# Altium schematic sheet Sheet1.SchDoc
size A
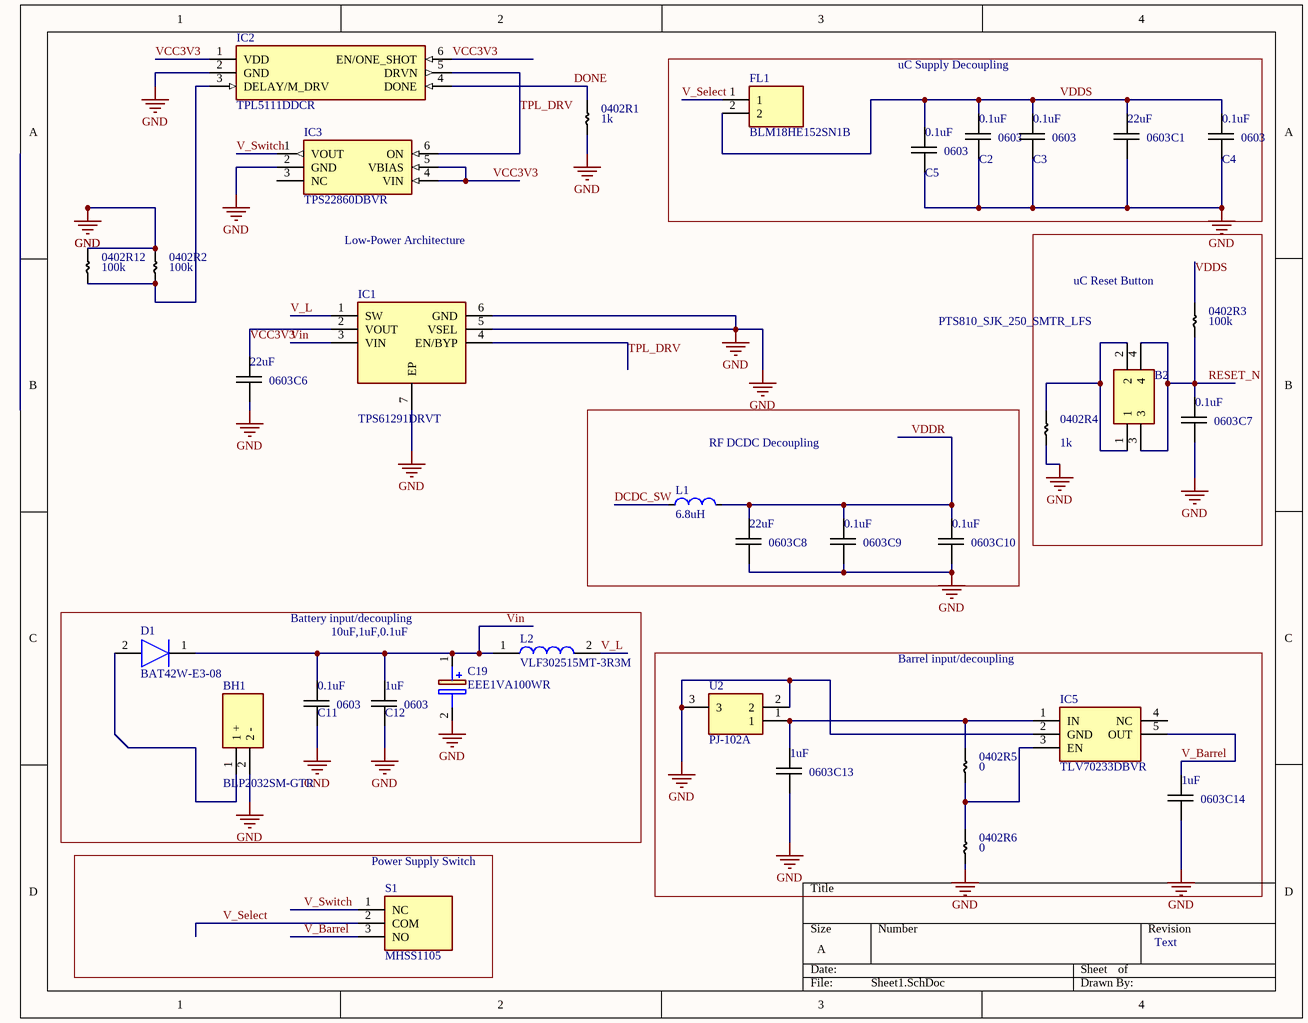
[diagram p0: Sheet1.SchDoc]

## Parts
B2  PTS810_SJK_250_SMTR_LFS  [PTS810SJK250SMTRLFS]
BH1  BLP2032SM-GTR  [BLP2032SMGTR]
C1  22uF  [0603_SMD]
C2  0.1uF  [0603_SMD]
C3  0.1uF  [0603_SMD]
C4  0.1uF  [0603_SMD]
C5  0.1uF  [0603_SMD]
C6  22uF  [0603_SMD]
C7  0.1uF  [0603_SMD]
C8  22uF  [0603_SMD]
C9  0.1uF  [0603_SMD]
C10  0.1uF  [0603_SMD]
C11  0.1uF  [0603_SMD]
C12  1uF  [0603_SMD]
C13  1uF  [0603_SMD]
C14  1uF  [0603_SMD]
C19  EEE1VA100WR  [CAPAE430X550N]
D1  BAT42W-E3-08  [SOD3716X135N]
FL1  BLM18HE152SN1B  [BEADC1608X95N]
IC1  TPS61291DRVT  [SON65P200X200X80-7N]
IC2  TPL5111DDCR  [SOT95P280X110-6N]
IC3  TPS22860DBVR  [SOT95P280X145-6N]
IC5  TLV70233DBVR  [SOT95P280X145-5N]
L1  value 6.8uH  [PASSIVE-INDUCTOR-0603]  (hidden comment: Passive-Inductor (Generic))
L2  VLF302515MT-3R3M  [VLF302515MT]
R1  1k  [0402_SMD]
R2  100k  [0402_SMD]
R3  100k  [0402_SMD]
R4  1k  [0402_SMD]
R5  0  [0402_SMD]
R6  0  [0402_SMD]
R12  100k  [0402_SMD]
S1  MHSS1105  [MHSS1105]
U2  PJ-102A  [PJ-102AH]

## Blocks framed on the sheet
uC Supply Decoupling: C1-C5 FL1
uC Reset Button: B2 C7 R3 R4
RF DCDC Decoupling: C8-C10 L1
Barrel input/decoupling: C13 C14 IC5 R5 R6 U2
Power Supply Switch: S1

## Nets
GND: BH1.2(2_-) C1.1 C2.1 C3.1 C4.1 C5.1 C6.1 C7.1 C8.1 C9.1 C10.1 C11.1 C12.1 C13.1 C14.1 C19.2(-) IC1.5(VSEL) IC1.6(GND) IC1.7(EP) IC2.2(GND) IC3.2(GND) IC5.2(GND) R1.2 R2.1 R4.2 R6.2 R12.1 U2.2 U2.3
DCDC_SW: L1.1
DONE: IC2.4(DONE) R1.1
RESET_N: B2.3 B2.4 C7.2 R3.2
TPL_DRV: IC1.4(EN/BYP) IC2.5(DRVN) IC3.6(ON)
V_Barrel: C14.2 IC5.5(OUT) S1.3(NO)
V_L: IC1.1(SW) L2.2
V_Select: FL1.1 S1.2(COM)
V_Switch: IC3.1(VOUT) S1.1(NC)
VCC3V3: C6.2 IC1.2(VOUT) IC2.1(VDD) IC2.6(EN/ONE_SHOT) IC3.4(VIN) IC3.5(VBIAS)
VDDR: C8.2 C9.2 C10.2 L1.2
VDDS: C1.2 C2.2 C3.2 C4.2 C5.2 FL1.2 R3.1
Vin: C11.2 C12.2 C19.1(+) D1.1(K) IC1.3(VIN) L2.1
NetB2_1: B2.1 B2.2 R4.1
NetBH1_1: BH1.1(1_+) D1.2(A)
NetC13_2: C13.2 IC5.1(IN) R5.1 U2.1
NetIC2_3: IC2.3(DELAY/M_DRV) R2.2 R12.2
NetIC5_3: IC5.3(EN) R5.2 R6.1

Not connected (* = marked no-connect by the designer): IC3 3(NC); IC5 4(NC)

## Notes on the sheet
- Low-Power Architecture
- (near C19) Battery input/decoupling
- 10uF,1uF,0.1uF
- Text
- (in symbol C_0603) 0603
- (in symbol R_0402) 0402

## Library data of the parts
B2 = PTS810_SJK_250_SMTR_LFS: Crystal or Oscillator; Manufacturer_Name: C & K COMPONENTS; Manufacturer_Part_Number: PTS810 SJK 250 SMTR LFS; Datasheet Link: https://www.ckswitches.com/media/1476/pts810.pdf; Height: 2mm; Mouser Part Number: 611-PTS810SJK250SMTR; Mouser Price/Stock: https://www.mouser.com/Search/Refine.aspx?Keyword=611-PTS810SJK250SMTR
BH1 = BLP2032SM-GTR: Undefined or Miscellaneous; Manufacturer_Name: MPD (Memory Protection Devices); Datasheet Link: http://www.memoryprotectiondevices.com/datasheets/BLP2032SM-GTR-datasheet.pdf; Height: 4.75mm; Manufacturer_Part_Number: BLP2032SM-GTR
C1-C14 = C_0603
C19 = EEE1VA100WR: Capacitor Polarised; Manufacturer_Name: Panasonic; Datasheet Link: https://industrial.panasonic.com/cdbs/www-data/pdf/RDE0000/ABA0000C1145.pdf; Height: 5.5mm; Manufacturer_Part_Number: EEE1VA100WR; RS Part Number: 1766382; RS Price/Stock: https://uk.rs-online.com/web/p/products/1766382
D1 = BAT42W-E3-08: Diode; Manufacturer_Name: Vishay; Datasheet Link: http://www.vishay.com/docs/85661/bat42w.pdf; Height: 1.35mm; Manufacturer_Part_Number: BAT42W-E3-08; Mouser Part Number: 78-BAT42W-E3-08; Mouser Price/Stock: https://www.mouser.com/Search/Refine.aspx?Keyword=78-BAT42W-E3-08; RS Part Number: 1808601P; RS Price/Stock: http://uk.rs-online.com/web/p/products/1808601P
FL1 = BLM18HE152SN1B: Filter; Manufacturer_Name: Murata Electronics; Datasheet Link: https://www.murata.com/en-us/products/productdetail?partno=BLM18HE152SN1%23; Height: 0.95mm; Manufacturer_Part_Number: BLM18HE152SN1B; Mouser Part Number: N/A; Mouser Price/Stock: https://www.mouser.com/Search/Refine.aspx?Keyword=N%2FA
IC1 = TPS61291DRVT: Integrated Circuit; Manufacturer_Name: Texas Instruments; Datasheet Link: http://uk.rs-online.com/web/p/products/9143112P; Height: 0.8mm; Manufacturer_Part_Number: TPS61291DRVT; Mouser Part Number: 595-TPS61291DRVT; Mouser Price/Stock: https://www.mouser.com/Search/Refine.aspx?Keyword=595-TPS61291DRVT; RS Part Number: 9143112P; RS Price/Stock: http://uk.rs-online.com/web/p/products/9143112P
IC2 = TPL5111DDCR: Undefined or Miscellaneous; Manufacturer_Name: Texas Instruments; Datasheet Link: http://www.ti.com/lit/ds/symlink/tpl5111.pdf; Height: 1.1mm; Manufacturer_Part_Number: TPL5111DDCR; Mouser Part Number: 595-TPL5111DDCR; Mouser Price/Stock: https://www.mouser.com/Search/Refine.aspx?Keyword=595-TPL5111DDCR
IC3 = TPS22860DBVR: Switch; Manufacturer_Name: Texas Instruments; Datasheet Link: http://www.ti.com/lit/gpn/tps22860; Height: 1.45mm; Manufacturer_Part_Number: TPS22860DBVR; Mouser Part Number: 595-TPS22860DBVR; Mouser Price/Stock: https://www.mouser.com/Search/Refine.aspx?Keyword=595-TPS22860DBVR
IC5 = TLV70233DBVR: Integrated Circuit; Manufacturer_Name: Texas Instruments; Datasheet Link: http://www.ti.com/lit/gpn/tlv702; Height: 1.45mm; Manufacturer_Part_Number: TLV70233DBVR; Mouser Part Number: 595-TLV70233DBVR; Mouser Price/Stock: https://www.mouser.com/Search/Refine.aspx?Keyword=595-TLV70233DBVR
L1 = Passive-Inductor (Generic): Generic Inductor; Category: Passive; Manufacturer: *; Supplier 2: Digi-Key; Manufacturer Part Number: *; Supplier 1: Mouser; Package: *; Supplier Part Number 1: *; Supplier Part Number 2: *; Through Hole (y/n): *
L2 = VLF302515MT-3R3M: Inductor; Manufacturer_Name: TDK; Datasheet Link: https://product.tdk.com/info/en/documents/wdcatalog/withdrawn_inductor_commercial_power_vlf302515mt_en.pdf; Manufacturer_Part_Number: VLF302515MT-3R3M; Mouser Part Number: 810-VLF302515MT-3R3M; Mouser Price/Stock: https://www.mouser.com/Search/Refine.aspx?Keyword=810-VLF302515MT-3R3M
R1-R6 R12 = R_0402
S1 = MHSS1105: Switch; Manufacturer_Name: Apem; Datasheet Link: https://componentsearchengine.com/Datasheets/2/MHSS1105.pdf; Height: 4mm; Manufacturer_Part_Number: MHSS1105; Mouser Part Number: 642-MHSS1105; Mouser Price/Stock: https://www.mouser.com/Search/Refine.aspx?Keyword=642-MHSS1105
U2 = PJ-102A: Connector; Manufacturer_Name: CUI; Datasheet Link: https://www.cui.com/product/resource/pj-102a.pdf; Manufacturer_Part_Number: PJ-102A; Mouser Part Number: 490-PJ-102A; Mouser Price/Stock: https://www.mouser.com/Search/Refine.aspx?Keyword=490-PJ-102A